# EAGLE design unicorder-mk-1.4-display (EAGLE 6.5.0)
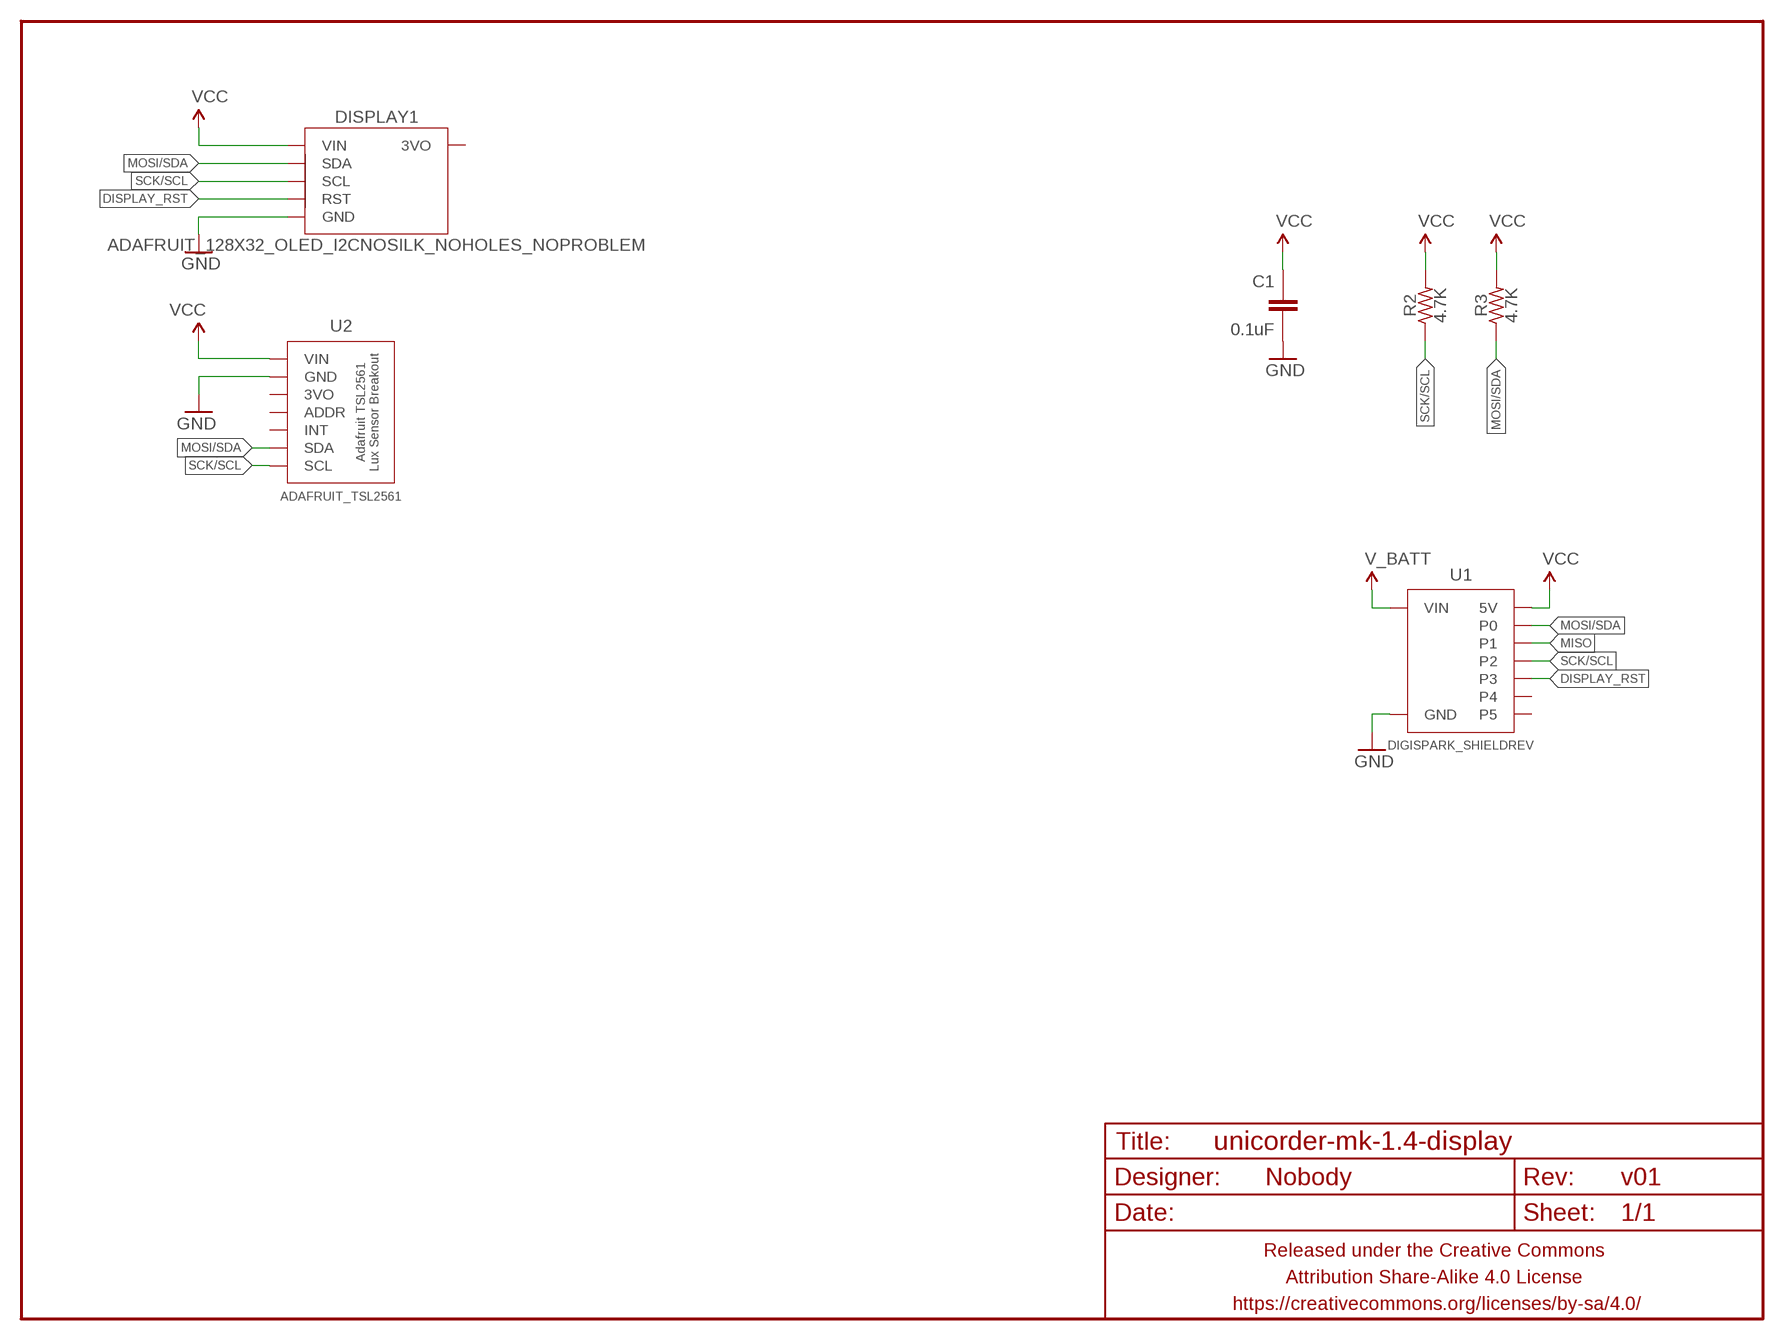
[diagram p0: schematic, sheet 1]

## Parts
C1  0.1uF  CAPACITOR-CERAMIC025-024X044  [C025-024X044]
DISPLAY1  ADAFRUIT_128X32_OLED_I2CNOSILK_NOHOLES_NOPROBLEM  [ADAFRUIT_128X32_OLED_I2C_CLOSER_NS]
FRAME1  FRAME-LETTERNO_PACKAGE  [DUMMY]
R2  4.7K  RESISTORPTH-AXIAL-7.62MM  [RESISTOR-AXIAL-PTH-7.62MM]
R3  4.7K  RESISTORPTH-AXIAL-7.62MM  [RESISTOR-AXIAL-PTH-7.62MM]
U1  DIGISPARK_SHIELDREV  [DIGISPARK_SHIELD_REV]
U2  ADAFRUIT_TSL2561  [ADAFRUIT_TSL2561]

## Nets
DISPLAY_RST: DISPLAY1.RST U1.P3
GND: C1.2 DISPLAY1.GND U1.GND U2.GND
MISO: U1.P1
MOSI/SDA: DISPLAY1.SDA R3.P$1 U1.P0 U2.SDA
SCK/SCL: DISPLAY1.SCL R2.P$1 U1.P2 U2.SCL
V_BATT: U1.VIN
VCC: C1.1 DISPLAY1.VIN R2.P$2 R3.P$2 U1.5V U2.VIN
Unconnected: DISPLAY1.3VO U1.P4 U1.P5 U2.3VO U2.ADDR U2.INT

## Library data of the parts
C1 = A_butts:CAPACITOR-CERAMIC: CAPACITOR, European symbol
DISPLAY1 = A_butts:ADAFRUIT_128X32_OLED_I2C
FRAME1 = A_butts:FRAME-LETTER: Schematic Frame Standard 8.5x11 US Letter frame; DESIGNER: Nobody; VERSION: v01
R2 R3 = A_butts:RESISTOR: RESISTOR, American symbol
U1 = A_butts:DIGISPARK_SHIELD
U2 = A_butts:ADAFRUIT_TSL2561

## Board
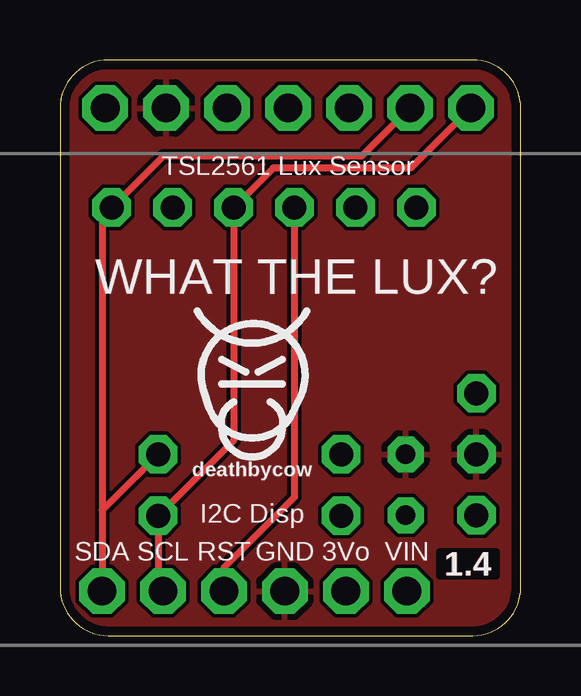
[diagram p1: board, top side]
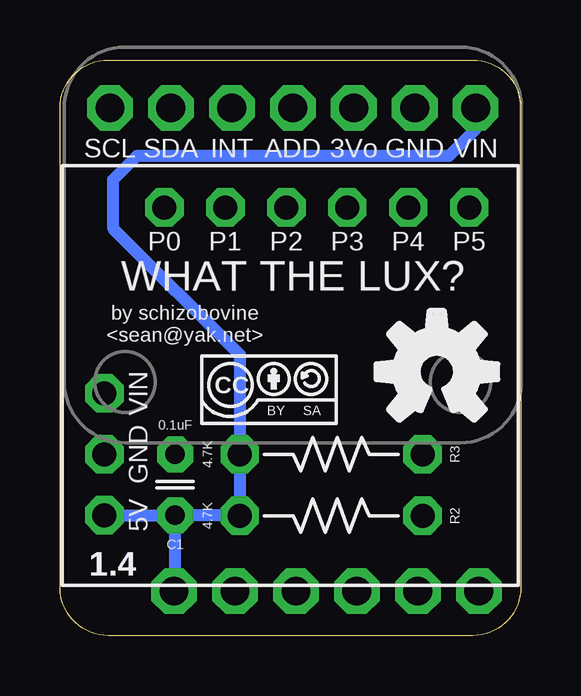
[diagram p2: board, bottom side, seen from below]

Size 19.2 x 24 mm. Coordinates in mm from the lower left corner, seen from the top.
Outline: 0,22 0,2 arc90 2,0 17.2,0 arc90 19.2,2 19.2,22 arc90 17.2,24 2,24 arc90 0,22
Copper layers (1*16): Top 0.0356mm / dielectric 1.5011mm / Bottom 0.0356mm
Design rules "LaenPCBOrder_2": minimum track width 6mil, minimum drill 13mil, track to track 6mil, track to pad 6mil, pad to pad 6mil, via to via 6mil, smd to smd 6mil, copper to edge 15mil, drill to drill 6mil, minimum pad ring 7mil, minimum via ring 7mil, stop-mask expansion 3mil, vias tented up to drill 20mil, thermal gap 10mil

### Footprints (pad centres in the part's own frame; a part is rotated, then mirrored left to right if it is on the bottom)
C025-024X044 = drill 0.813 pad 1.5 octagon: 1 -1.27,0; 2 1.27,0
ADAFRUIT_128X32_OLED_I2C_CLOSER_NS = drill 1.2 pad 1.9 octagon: 3VO 3.81,0; GND 1.27,0; RST -1.27,0; SCL -3.81,0; SDA -6.35,0; VIN 6.35,0
RESISTOR-AXIAL-PTH-7.62MM = drill 1 pad 1.6 octagon: P$1 -3.81,0; P$2 3.81,0
DIGISPARK_SHIELD_REV = drill 1 pad 1.6 octagon: 5V -5.83,-7.75; GND -3.29,-7.75; P0 7,7.45; P1 7,4.91; P2 7,2.37; P3 7,-0.17; P4 7,-2.71; P5 7,-5.25; VIN -0.75,-7.75
ADAFRUIT_TSL2561 = drill 1.2 pad 1.9 octagon: 3VO -2.54,0; ADDR 0,0; GND -5.08,0; INT 2.54,0; SCL 7.62,0; SDA 5.08,0; VIN -7.62,0

### Placement (x,y rotation side)
C1  14.4,6.29 90 bottom
DISPLAY1  8.1,1.85 0 top
FRAME1  -0.1,0 0 top
R2  7.9,5 180 bottom
R3  7.9,7.56 180 bottom
U1  9.6,10.85 90 top
U2  9.5,22 180 bottom
U$1  [CC-BY-SA-4.0-NO-URL]  10.5,10.25 0 bottom
U$2  [COW_SMALL]  8,11 0 top
U$3  [OSHWLOGO_TOP_0.2]  3.5,11 0 bottom

### Tracks (layer width: path | path; a pad name or v marks a point on that pad's centre or on a via)
DISPLAY_RST
  Top 0.3: U1.P3 9.77,5.77 6.83,2.83 DISPLAY1.RST
GND
  pour Top: -0.1,-0.1 -0.1,24.1 19.3,24.1 19.3,-0.1
MOSI/SDA
  Top 0.3: U2.SDA 12.58,20 4.3,20 U1.P0 1.75,17.45 DISPLAY1.SDA 1.75,5.22 R3.P$1
SCK/SCL
  Top 0.3: U2.SCL 14.62,19.5 8.88,19.5 U1.P2 7.23,8.14 R2.P$1 4.09,2.05 DISPLAY1.SCL
VCC
  Bottom 0.5: U2.VIN 1.88,21.12 3,20 16,20 17,19 17,17 11.71,11.71 R3.P$2 R2.P$2 11.73,5.02 C1.1 | U1.5V C1.1 | DISPLAY1.VIN 14.4,1.9 C1.1

### Text on the board
tPlace: TSL2561 Lux Sensor | WHAT THE LUX? | I2C Disp
bPlace: SCL | SDA | INT | ADDR | 3Vo | GND | WHAT THE LUX? | by schizobovine / <sean@yak.net> | VIN